# Altium schematic sheet pa.SchDoc: Power Amplifier
size Letter; CheckedBy: J. Brinton; CompanyName: Signal Laboratories, Inc.; DrawnBy: J. Brinton; Engineer: J. Brinton; Address1: 3479 Edison Way; Address2: Menlo Park CA 94025; Address3: +1 (877) 778-8435; Address4: siglabs.com; Revision: 3; SheetNumber: 10; SheetTotal: 49; ModifiedDate: 4/20/2018
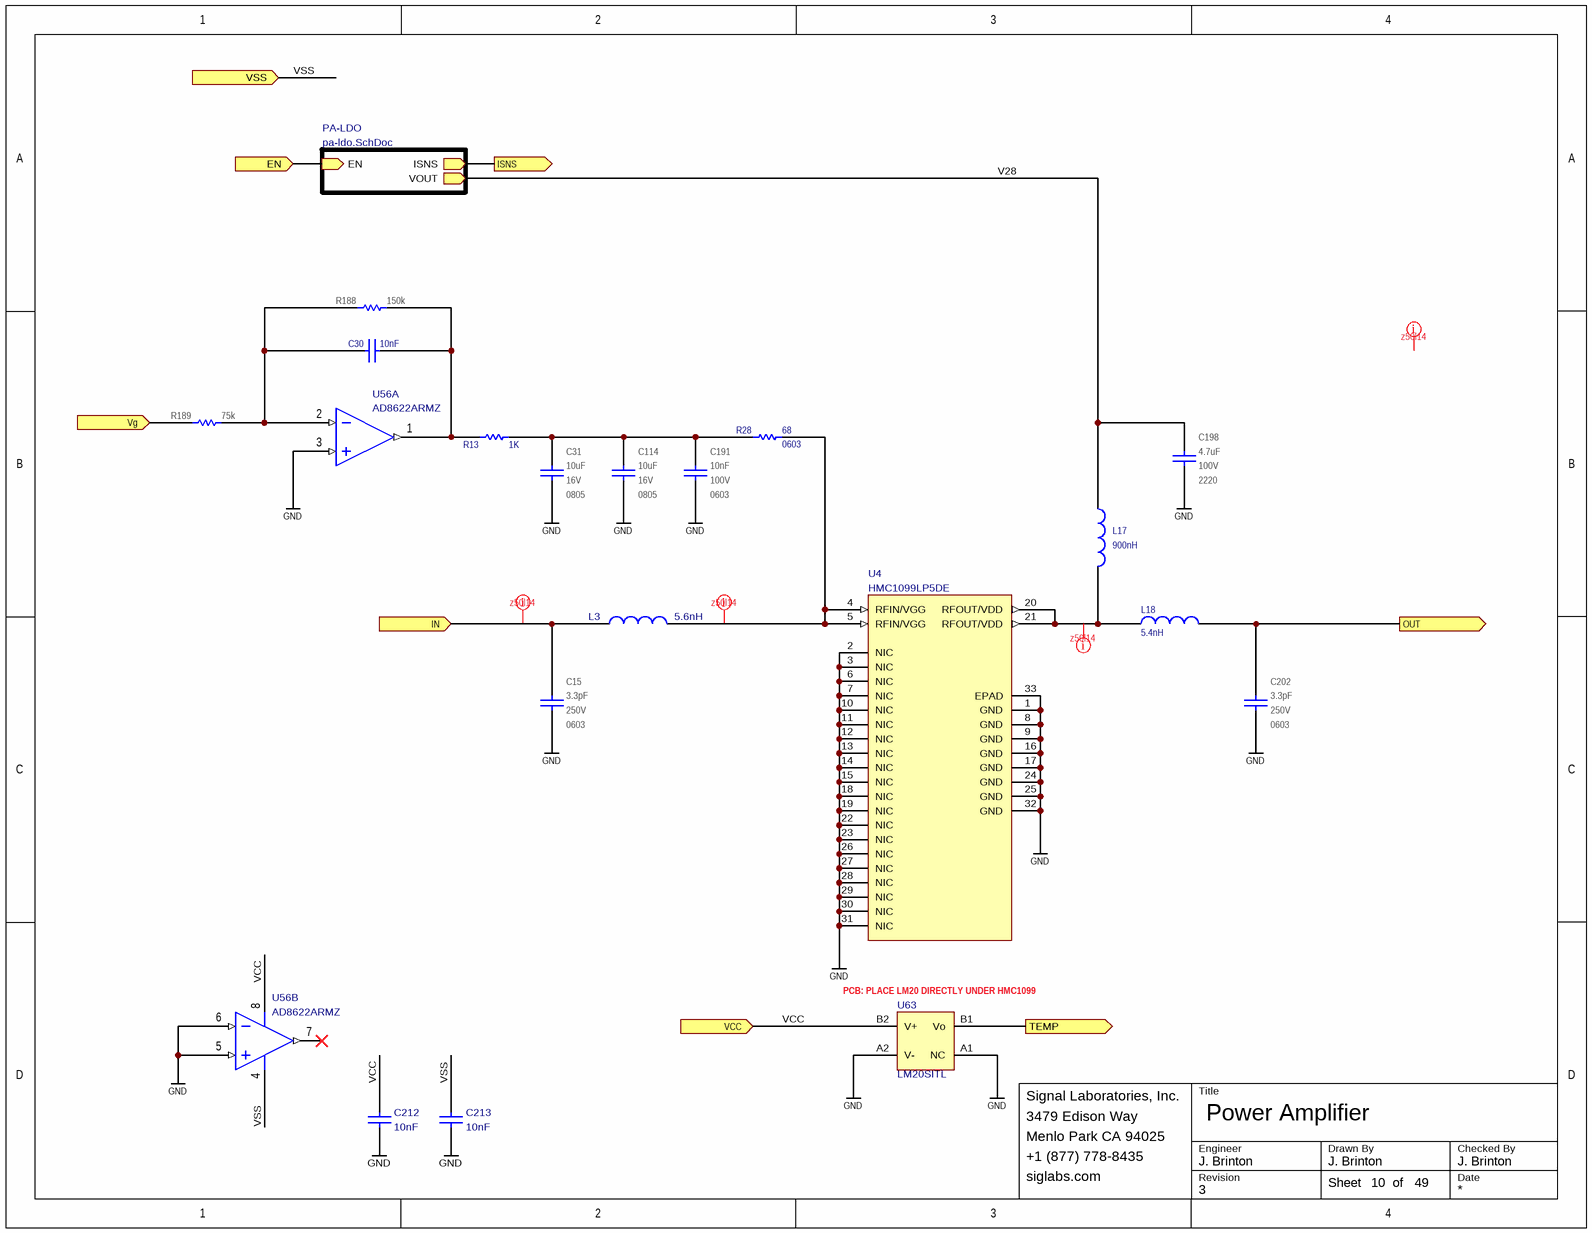
[diagram p0: pa.SchDoc]

## Parts
C15  value 3.3pF  Voltage: 250V  Package: 0603  [CAPC160X80X90L20N]  (hidden comment: 251R14S3R3BV4T)
C30  value 10nF  [CAPC100X50X55L25N]  (hidden comment: GRM155R71H103KA88)
C31  value 10uF  Voltage: 16V  Package: 0805  [CAPC2012X145N]  (hidden comment: 0805YD106MAT2A)
C114  value 10uF  Voltage: 16V  Package: 0805  [CAPC2012X145N]  (hidden comment: 0805YD106MAT2A)
C191  value 10nF  Voltage: 100V  Package: 0603  [CAPC1608X90N]  (hidden comment: 06031C103JAT2A)
C198  value 4.7uF  Voltage: 100V  Package: 2220  [CAPC570X500X230L57N]  (hidden comment: C5750X7R2A475K230KA)
C202  value 3.3pF  Voltage: 250V  Package: 0603  [CAPC160X80X90L20N]  (hidden comment: 251R14S3R3BV4T)
C212  value 10nF  [CAPC100X50X55L25N]  (hidden comment: GRM155R71H103KA88)
C213  value 10nF  [CAPC100X50X55L25N]  (hidden comment: GRM155R71H103KA88)
L3  value 5.6nH  [INDC1005X55N]  (hidden comment: LQG15HS5N6C02D)
L17  value 900nH  [COILCRAFT_1008AF]  (hidden comment: 1008AF-901XJLC)
L18  value 5.4nH  [0906-5L]  (hidden comment: 0906-5GL)
R13  value 1K  [RESC1005X40N]  (hidden comment: RC0402FR-071KL)
R28  value 68  Package: 0603  [RESC1608X55N]  (hidden comment: MCT06030C6809FP500)
R188  value 150k  [RESC1005X40N]  (hidden comment: ERJ-2RKF1503X)
R189  value 75k  [RESC1005X40N]  (hidden comment: ERJ-2RKF7502X)
U4  HMC1099LP5DE  [QFN50P500X500X153-33N]
U56  AD8622ARMZ  [MSOP8]  (parts A,B of 2)
U63  LM20SITL  [YZR-4]

## Sub-sheets
PA-LDO = pa-ldo.SchDoc: ISNS (out), EN (in), VOUT (out)

## Ports
EN (in), IN (in), ISNS (out), OUT (out), TEMP (out), VCC (in), Vg (in), VSS (in)

## Nets
GND: C15.1 C31.1 C114.1 C191.1 C198.1 C202.1 C212.2 C213.2 U4.1(GND) U4.2(NIC) U4.3(NIC) U4.6(NIC) U4.7(NIC) U4.8(GND) U4.9(GND) U4.10(NIC) U4.11(NIC) U4.12(NIC) U4.13(NIC) U4.14(NIC) U4.15(NIC) U4.16(GND) U4.17(GND) U4.18(NIC) U4.19(NIC) U4.22(NIC) U4.23(NIC) U4.24(GND) U4.25(GND) U4.26(NIC) U4.27(NIC) U4.28(NIC) U4.29(NIC) U4.30(NIC) U4.31(NIC) U4.32(GND) U4.33(EPAD) U56.3(IN+) U56.5(IN+) U56.6(IN-) U63.A1(NC) U63.A2(V-)
EN: port EN, sheet PA-LDO/EN
IN: C15.2 L3.1 ; port IN
ISNS: port ISNS, sheet PA-LDO/ISNS
OUT: C202.2 L18.2 ; port OUT
TEMP: U63.B1(Vo) ; port TEMP
V28: C198.2 L17.1 ; sheet PA-LDO/VOUT
VCC: C212.1 U56.8(V+) U63.B2(V+) ; port VCC
Vg: R189.2 ; port Vg
VSS: C213.1 U56.4(V-) ; port VSS
NetC30_1: C30.1 R13.2 R188.1 U56.1(OUT)
NetC30_2: C30.2 R188.2 R189.1 U56.2(IN-)
NetC31_2: C31.2 C114.2 C191.2 R13.1 R28.1
NetL3_2: L3.2 R28.2 U4.4(RFIN/VGG) U4.5(RFIN/VGG)
NetL17_2: L17.2 L18.1 U4.20(RFOUT/VDD) U4.21(RFOUT/VDD)

Not connected (* = marked no-connect by the designer): U56 7(OUT)*

## Layout directives
net class z50l14: (no net found under the mark), IN, NetL3_2, NetL17_2

## Notes on the sheet
- (near U63) PCB: PLACE LM20 DIRECTLY UNDER HMC1099
- Title
- Engineer
- Revision
- Drawn By
- Checked By
- Date
- Sheet
- of

## Library data of the parts
C15 C202 = CAP: Ceramic Capacitor 3.3pF ±0.1pF 250V C0G 0603; Manufacturer: Johanson Technology; Tr: -55:125; Manufacturer P/N: 251R14S3R3BV4T; Tolerance: ±0.1pF
C30 = CAP 0402: Ceramic Capacitor 10nF ±10% 50V X7R 0402; Manufacturer: Murata; Tr: -55:125; Voltage: 50V; Manufacturer P/N: GRM155R71H103KA88; Package: 0402; Tolerance: ±10%
C31 C114 = CAP: Ceramic Capacitor 10uF ±20% 16V X5R 0805; Manufacturer: AVX; Tr: -55:85; Manufacturer P/N: 0805YD106MAT2A; Tolerance: ±20%
C191 = CAP: Ceramic Capacitor 10nF ±5% 100V X7R 0603; Manufacturer: AVC; Tr: -55:125; Manufacturer P/N: 06031C103JAT2A; Tolerance: ±5%
C198 = CAP: Ceramic Capacitor 4.7uF ±10% 100V X7R 2220; Manufacturer: TDK; Tr: -55:125; Manufacturer P/N: C5750X7R2A475K230KA; Tolerance: ±10%
C212 C213 = TMK105B7103KV: Ceramic Capacitor 10nF ±10% 50V X7R 0402; Manufacturer: Murata; Tr: -55:125; Manufacturer P/N: GRM155R71H103KA88; Tolerance: ±10%; Package: 0402; Voltage: 50V
L3 = INDUCTOR: Inductor 5.6nH ±0.2nH 650mA; Manufacturer: Murata; Manufacturer P/N: LQG15HS5N6C02D
L17 = INDUCTOR: Inductor 900nH ±5% 1008; Manufacturer: Coilcraft; Tr: -40:125; Manufacturer P/N: 1008AF-901XJLC; Package: 1008; Tolerance: ±5%
L18 = INDUCTOR: Inductor 5.4nH ±2% SMD; Manufacturer: Coilcraft; Tr: -40:140; Manufacturer P/N: 0906-5GL; Package: 0906-5L; Tolerance: ±2%
R13 = RES 0402: Thick Film Resistor 1k ±1% 0402; Manufacturer: Yageo; Tr: -55:155; Package: 0402; Manufacturer P/N: RC0402FR-071KL; Do Not Place: *; Tolerance: ±1%
R28 = RES 0402: Thick Film 68 ±1% 0603; Manufacturer: Vishay; Tr: -55:155; Manufacturer P/N: MCT06030C6809FP500; Tolerance: ±1%
R188 = RES: Thick Film Resistor 150k ±1% 0.1W 50V 0402; Manufacturer: Panasonic; Tcr: ±100; Tr: -55:155; Voltage: 50; Power: 0.1; Manufacturer P/N: ERJ-2RKF1503X; Tolerance: ±1%; Alternatives: *; Footprint: *; Package: 0402
R189 = RES: Thick Film Resistor 75k ±1% 0.1W 50V 0402; Manufacturer: Panasonic; Tcr: ±100; Tr: -55:155; Voltage: 50; Power: 0.1; Manufacturer P/N: ERJ-2RKF7502X; Tolerance: ±1%; Alternatives: *; Footprint: *; Package: 0402
U4 = HMC1099LP5DE: RF Amp Chip Single Power Amplifier 1.1GHz 32V 32-Pin QFN; MF: Analog Devices; SnapEDA_Link: https://www.snapeda.com/parts/HMC1099LP5DE/Analog%20Devices%20/%20Linear%20Technology/view-part/?ref=snap; MP: HMC1099LP5DE; Availability: Bad; Price: 92.57 USD; Package: QFN-32 Analog Devices; Value: *
U56 = AD8022: Low Power, Precision Rail-to-Rail Output Op Amp MSOP; Manufacturer: Analog Devices; Manufacturer P/N: AD8622ARMZ
U63 = LM20SITL: Analog Temperature Sensor; Manufacturer: Texas Instruments; Manufacturer P/N: LM20SITL; Package: DSBGA-4